# Altium schematic sheet APDS9960.SchDoc: APDS9960.SchDoc
size 558 x 431 mm; Date: 2/16/2022; Author: Xitong Zheng, Hongliang Chen; SheetNumber: 2; SheetTotal: 11
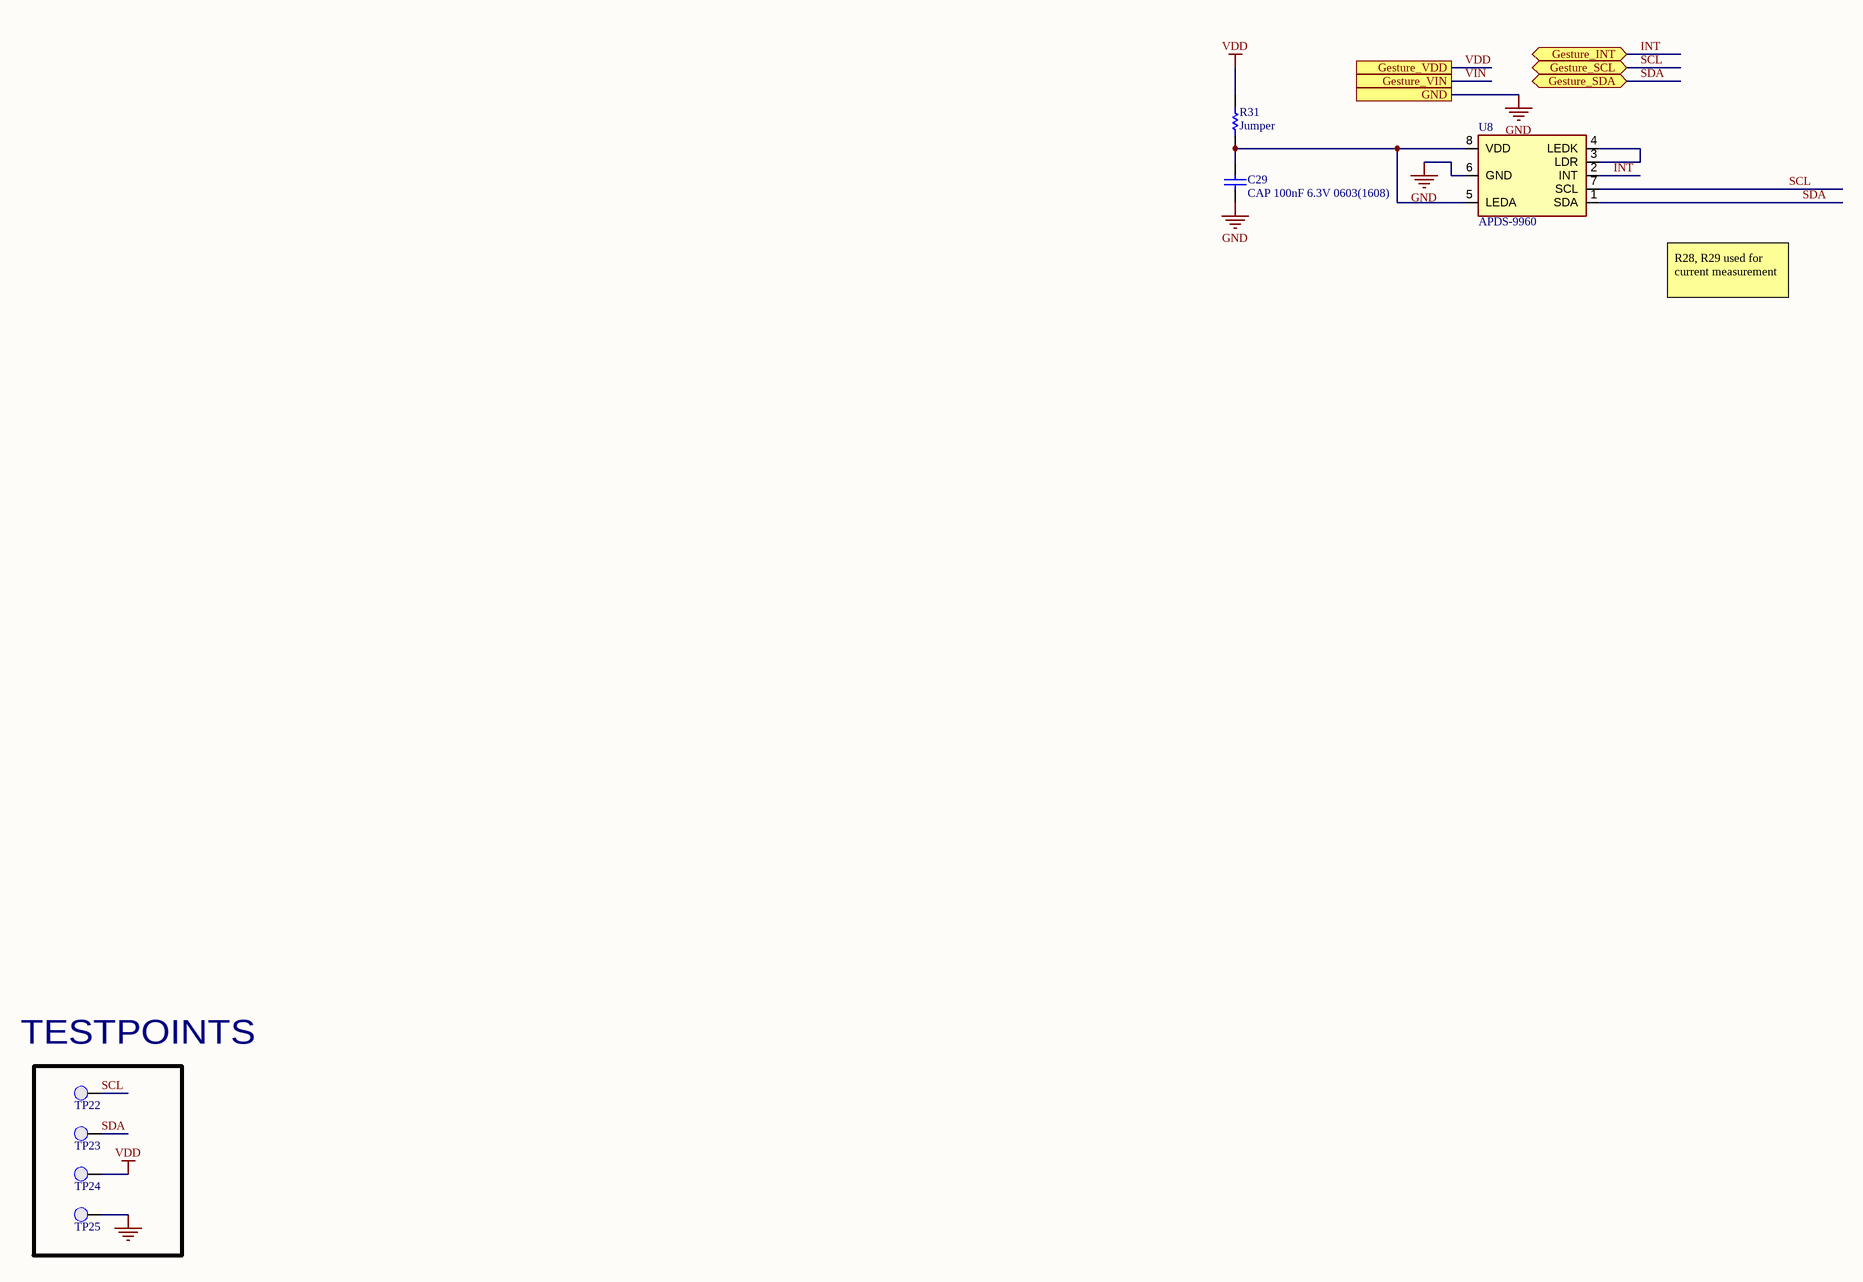
[diagram p0: APDS9960.SchDoc]

## Parts
C29  CAP 100nF 6.3V 0603(1608)  [CAPC0603(1608)100_M]
R31  Jumper  [RESC0603(1608)_N]
TP22  0.1" Pad  [PCBComponent]  (value not drawn)
TP23  0.1" Pad  [PCBComponent]  (value not drawn)
TP24  0.1" Pad  [PCBComponent]  (value not drawn)
TP25  0.1" Pad  [PCBComponent]  (value not drawn)
U8  APDS-9960  [APDS-9960]

## Ports
Gesture_INT (bidir), Gesture_SCL (bidir), Gesture_SDA (bidir), Gesture_VDD, Gesture_VIN, GND

## Nets
GND: C29.2 TP25.1(PAD) U8.6(GND) ; port GND
VDD: R31.1 TP24.1(PAD) ; port Gesture_VDD
INT: U8.2(INT) ; port Gesture_INT
SCL: TP22.1(PAD) U8.7(SCL) ; port Gesture_SCL
SDA: TP23.1(PAD) U8.1(SDA) ; port Gesture_SDA
VIN: port Gesture_VIN
NetC29_1: C29.1 R31.2 U8.5(LEDA) U8.8(VDD)
NetU8_3: U8.3(LDR) U8.4(LEDK)

## Notes on the sheet
- R28, R29 used for current measurement
- (near TP22) TESTPOINTS
- DWG. NO.
- REV.
- SHT.
- REVISION
- DESCRIPTION
- DATE
- APPROVED
- THIS DOCUMENT AND THE DATA DISCLOSED HEREIN OR HEREWITH IS THE PROPERTY OF ALTIUM LIMITED AND MAY BE FREELY DISTRIBUTED IN WHOLE. NO RIGHTS ARE RESERVED OR EXPRESS OR IMPLIED WARANTEE GIVEN.
- ENG:
- DSN:
- APPROVALS
- PROJECT
- DOCUMENT REVISION:
- DESIGN ITEM:
- CHK:
- BOM:
- REFERENCE DOCUMENTS
- PROJECT REVISION:
- TITLE
- FAB DWG:
- PCB DWG:
- ASSY DWG:
- SCALE:
- SIZE
- C
- CAGE CODE
- FILE NAME
- DWG NO.
- SHEET
- OF
- REV

## Library data of the parts
C29 = CMP-1035-02575-1: CAP 100nF 6.3V ±5% 0603 (1608 Metric) Thickness 1mm SMD; Tolerance: Â±5%; Case-Metric: 1608; Case-EIA: 0603; Technology: SMT; Rated Voltage: 6.3 V; Max Thickness: 1 mm; Value: 100nF
R31 = CMP-1012-00001-1: Jumper 0603 (1608 Metric); Case-Metric: 1608; Value: 0.00 Ohm; Power: None; Case-EIA: 0603; Technology: SMT; Tolerance: None
TP22-TP25 = 0.1" Pad-A.4
U8 = APDS-9960: <h3>Avago APDS-9960 Digital Proximity, Ambient Light, RGB, and Gesture Sensor.</h3> <p>The APDS-9960 offers ambient light and color measuring, proximity detection, and touchless gesture sensing. It features UV and IR blocking filters, four separate diodes sensitive to different directions, and an I2C compatible interface.</p> <p><a href="https://cdn.sparkfun.com/datasheets/Sensors/Proximity/apds9960.pdf">Datasheet</a></p> <h4>SparkFun Products</h4> <ul> <li><a href="https://www.sparkfun.com/products/12787">SparkFun RGB and Gesture Sensor - APDS-9960</a> (SEN-12787)</li> </ul>; MF: {'manufacturer': u'Broadcom Limited'}; Value: *; Package: None; Availability: Unavailable; MP: APDS-9960; Price: None